# EAGLE design arduino_board_shield (EAGLE 5.11)
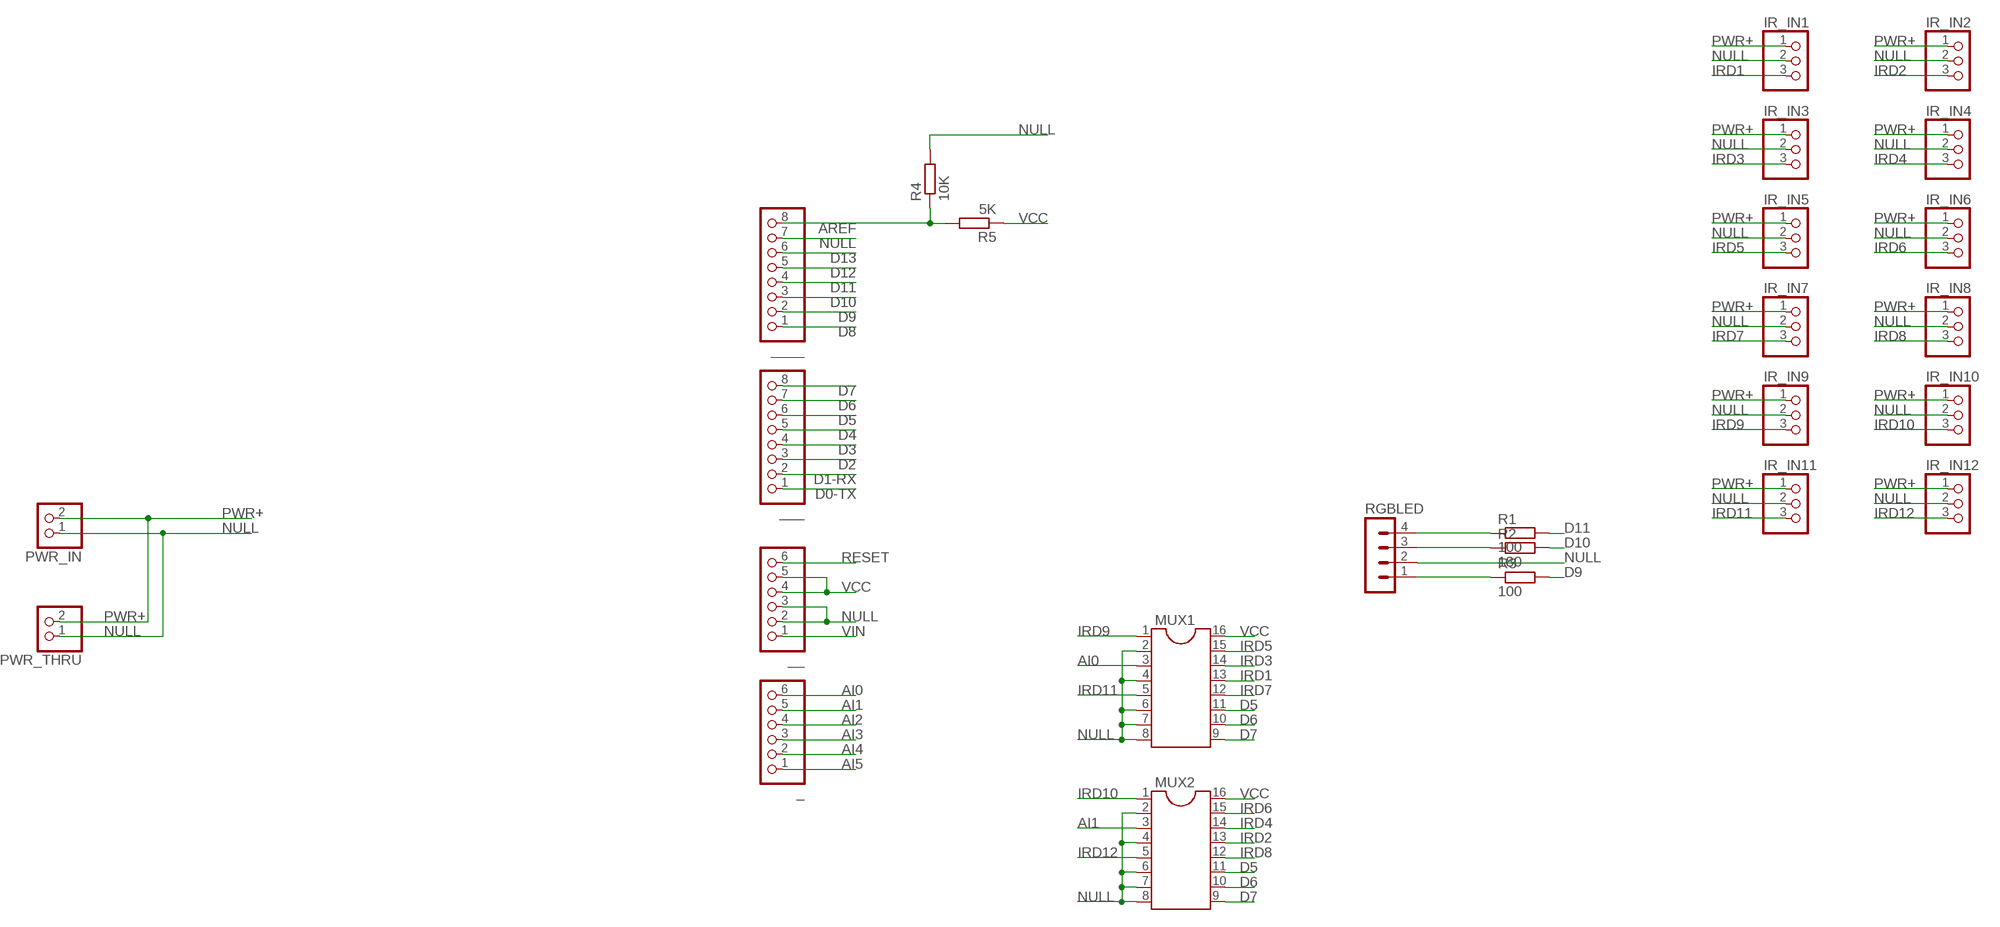
[diagram p0: schematic, sheet 1]

## Parts
_  PINHD-1X6  [1X06]
__  PINHD-1X6  [1X06]
___  PINHD-1X8  [1X08]
____  PINHD-1X8  [1X08]
IR_IN1  PINHD-1X3  [1X03]
IR_IN2  PINHD-1X3  [1X03]
IR_IN3  PINHD-1X3  [1X03]
IR_IN4  PINHD-1X3  [1X03]
IR_IN5  PINHD-1X3  [1X03]
IR_IN6  PINHD-1X3  [1X03]
IR_IN7  PINHD-1X3  [1X03]
IR_IN8  PINHD-1X3  [1X03]
IR_IN9  PINHD-1X3  [1X03]
IR_IN10  PINHD-1X3  [1X03]
IR_IN11  PINHD-1X3  [1X03]
IR_IN12  PINHD-1X3  [1X03]
MUX1  DIL16S  [SOCKET-16]
MUX2  DIL16S  [SOCKET-16]
PWR_IN  PINHD-1X2  [1X02]
PWR_THRU  PINHD-1X2  [1X02]
R1  100  R-EU_0204/7  [0204/7]
R2  180  R-EU_0204/7  [0204/7]
R3  100  R-EU_0204/7  [0204/7]
R4  10K  R-EU_0204/7  [0204/7]
R5  5K  R-EU_0204/7  [0204/7]
RGBLED  MA04-1  [MA04-1]

## Nets
AI0: _.6 MUX1.3
AI1: _.5 MUX2.3
AI2: _.4
AI3: _.3
AI4: _.2
AI5: _.1
AREF: ____.8 R4.1 R5.2
D0-TX: ___.1
D1-RX: ___.2
D2: ___.3
D3: ___.4
D4: ___.5
D5: ___.6 MUX1.11 MUX2.11
D6: ___.7 MUX1.10 MUX2.10
D7: ___.8 MUX1.9 MUX2.9
D8: ____.1
D9: ____.2 R3.2
D10: ____.3 R2.2
D11: ____.4 R1.2
D12: ____.5
D13: ____.6
IRD1: IR_IN1.3 MUX1.13
IRD2: IR_IN2.3 MUX2.13
IRD3: IR_IN3.3 MUX1.14
IRD4: IR_IN4.3 MUX2.14
IRD5: IR_IN5.3 MUX1.15
IRD6: IR_IN6.3 MUX2.15
IRD7: IR_IN7.3 MUX1.12
IRD8: IR_IN8.3 MUX2.12
IRD9: IR_IN9.3 MUX1.1
IRD10: IR_IN10.3 MUX2.1
IRD11: IR_IN11.3 MUX1.5
IRD12: IR_IN12.3 MUX2.5
N$1: R3.1 RGBLED.1
N$2: R2.1 RGBLED.3
N$3: R1.1 RGBLED.4
NULL: __.2 __.3 ____.7 IR_IN1.2 IR_IN2.2 IR_IN3.2 IR_IN4.2 IR_IN5.2 IR_IN6.2 IR_IN7.2 IR_IN8.2 IR_IN9.2 IR_IN10.2 IR_IN11.2 IR_IN12.2 MUX1.2 MUX1.4 MUX1.6 MUX1.7 MUX1.8 MUX2.2 MUX2.4 MUX2.6 MUX2.7 MUX2.8 PWR_IN.1 PWR_THRU.1 R4.2 RGBLED.2
PWR+: IR_IN1.1 IR_IN2.1 IR_IN3.1 IR_IN4.1 IR_IN5.1 IR_IN6.1 IR_IN7.1 IR_IN8.1 IR_IN9.1 IR_IN10.1 IR_IN11.1 IR_IN12.1 PWR_IN.2 PWR_THRU.2
RESET: __.6
VCC: __.4 __.5 MUX1.16 MUX2.16 R5.1
VIN: __.1

## Library data of the parts
_ __ = pinhead:PINHD-1X6: PIN HEADER
___ ____ = pinhead:PINHD-1X8: PIN HEADER
IR_IN1-IR_IN12 = pinhead:PINHD-1X3: PIN HEADER
MUX1 MUX2 = ic-package:DIL16: Dual In Line / Socket
PWR_IN PWR_THRU = pinhead:PINHD-1X2: PIN HEADER
R1-R5 = resistor:R-EU_: RESISTOR, European symbol
RGBLED = con-lstb:MA04-1: PIN HEADER

## Board
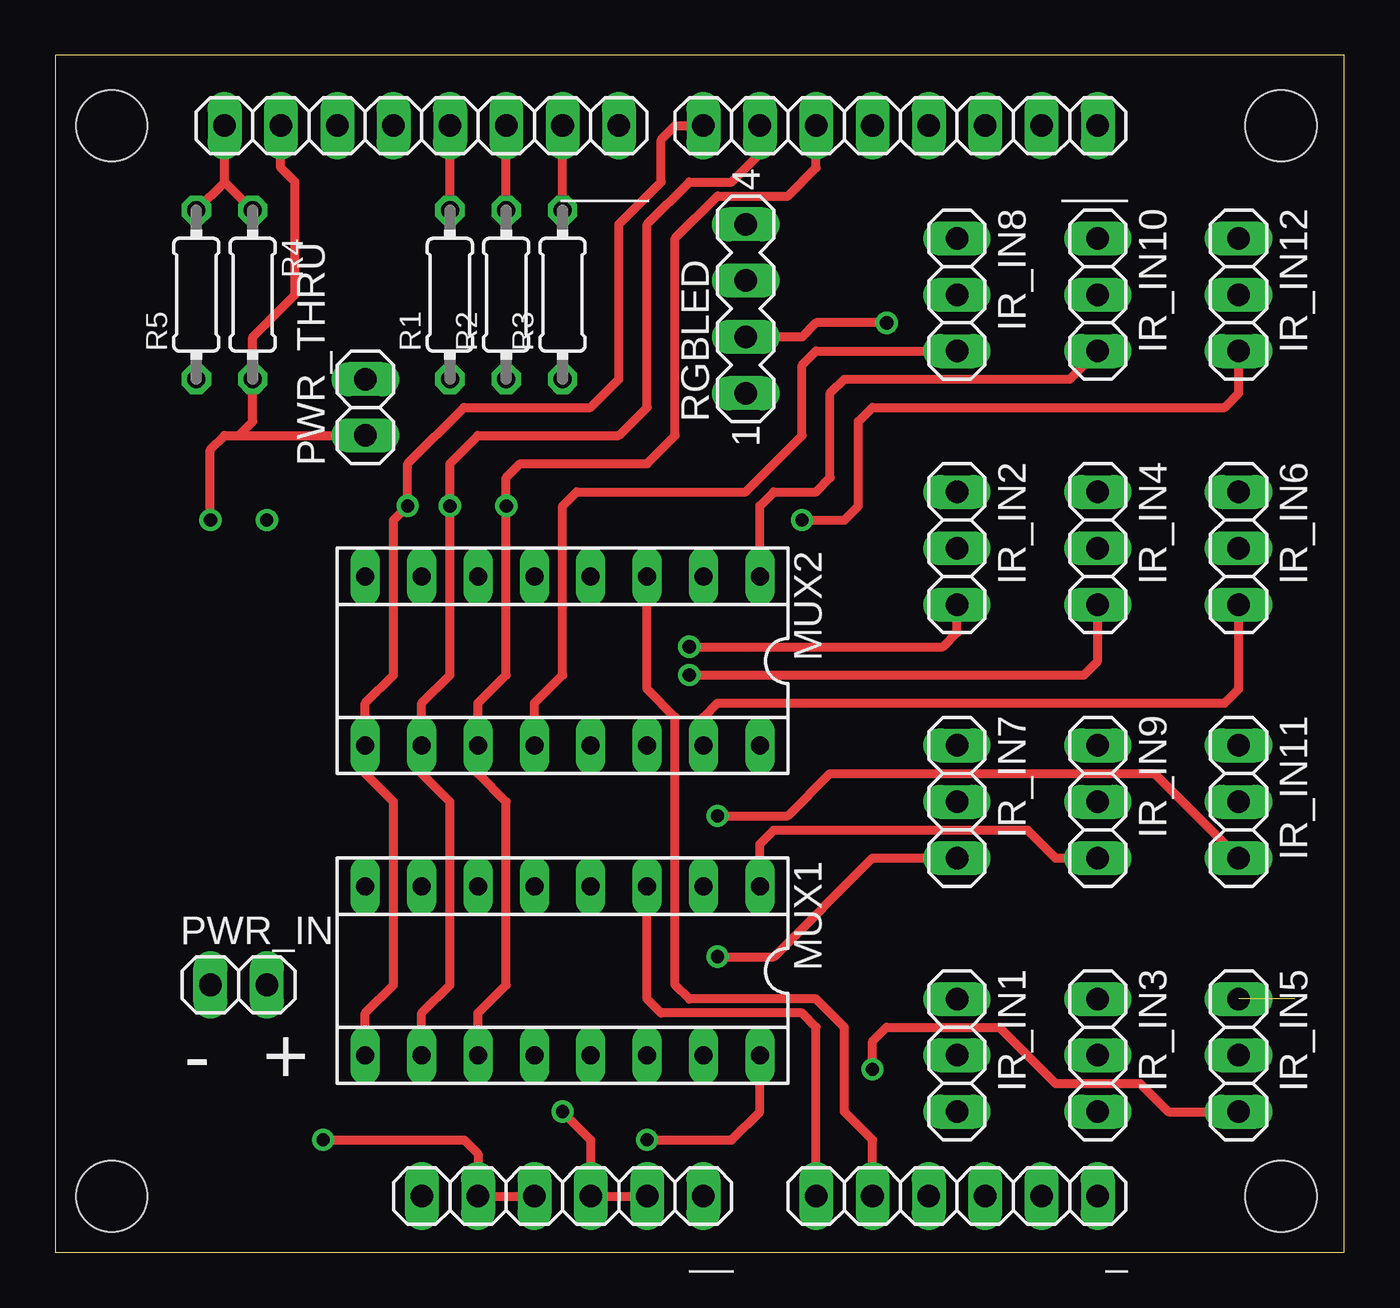
[diagram p1: board, top side]
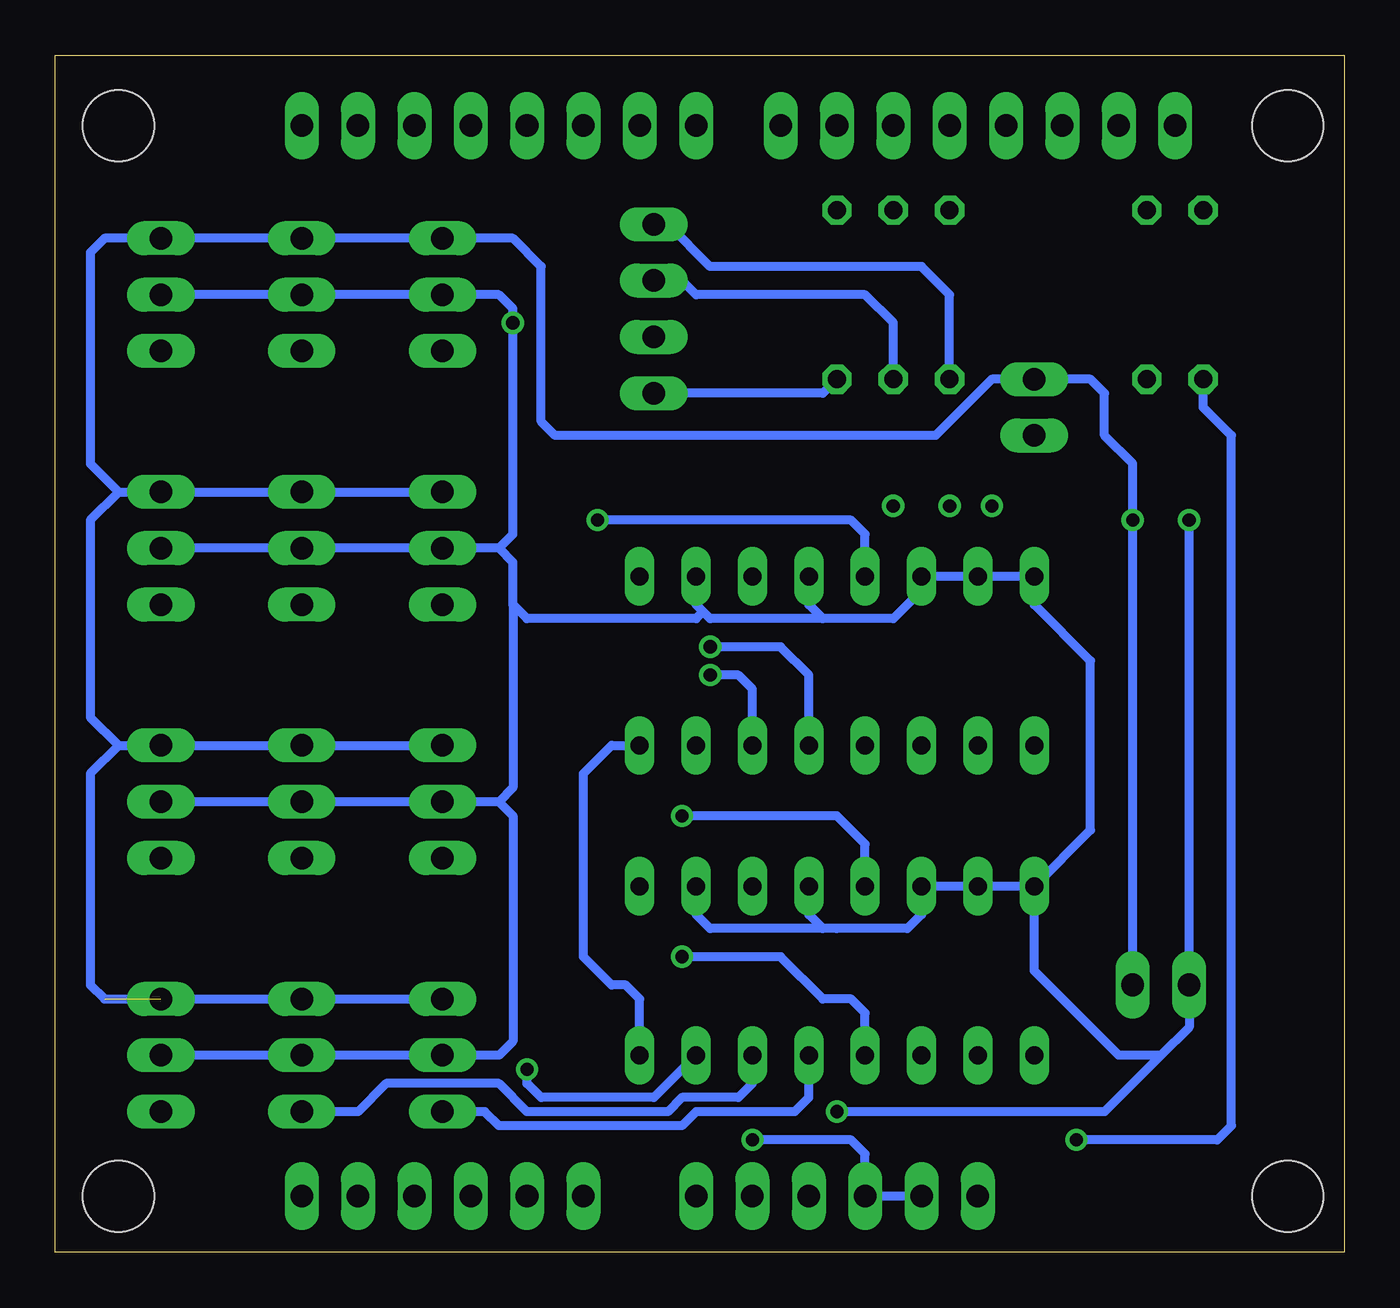
[diagram p2: board, bottom side, seen from below]

Size 58.09 x 53.97 mm. Coordinates in mm from the lower left corner, seen from the top.
Outline: 0,0 58.09,0 58.09,53.97 0,53.97 0,0
Copper layers (1*16): Top 0.035mm / dielectric 1.5mm / Bottom 0.035mm
Design rules "default": minimum track width 10mil, minimum drill 24mil, track to track 8mil, track to pad 8mil, pad to pad 8mil, via to via 8mil, smd to smd 8mil, copper to edge 40mil, drill to drill 8mil, minimum pad ring 10mil, minimum via ring 8mil, stop-mask expansion 4mil, vias tented up to drill 0mil, thermal gap 10mil
Holes 3.2 mm at 2.54,2.54 2.54,50.8 55.24,50.8 55.24,2.54

### Footprints (pad centres in the part's own frame; a part is rotated, then mirrored left to right if it is on the bottom)
1X06 = drill 1.016 long: 1 -6.35,0; 2 -3.81,0; 3 -1.27,0; 4 1.27,0; 5 3.81,0; 6 6.35,0
1X08 = drill 1.016 long: 1 -8.89,0; 2 -6.35,0; 3 -3.81,0; 4 -1.27,0; 5 1.27,0; 6 3.81,0; 7 6.35,0; 8 8.89,0
1X03 = drill 1.016 long: 1 -2.54,0; 2 0,0; 3 2.54,0
SOCKET-16 = drill 0.813 long: 1 -8.89,-3.81; 2 -6.35,-3.81; 3 -3.81,-3.81; 4 -1.27,-3.81; 5 1.27,-3.81; 6 3.81,-3.81; 7 6.35,-3.81; 8 8.89,-3.81; 9 8.89,3.81; 10 6.35,3.81; 11 3.81,3.81; 12 1.27,3.81; 13 -1.27,3.81; 14 -3.81,3.81; 15 -6.35,3.81; 16 -8.89,3.81
1X02 = drill 1.016 long: 1 -1.27,0; 2 1.27,0
0204/7 = drill 0.813 octagon: 1 -3.81,0; 2 3.81,0
MA04-1 = drill 1.016 long: 1 -3.81,0; 2 -1.27,0; 3 1.27,0; 4 3.81,0

### Placement (x,y rotation side)
_  40.64,2.54 180 top
__  22.86,2.54 180 top
___  38.1,50.8 180 top
____  16.51,50.8 180 top
IR_IN1  40.64,8.89 270 top
IR_IN2  40.64,31.75 270 top
IR_IN3  46.99,8.89 270 top
IR_IN4  46.99,31.75 270 top
IR_IN5  53.34,8.89 270 top
IR_IN6  53.34,31.75 270 top
IR_IN7  40.64,20.32 270 top
IR_IN8  40.64,43.18 270 top
IR_IN9  46.99,20.32 270 top
IR_IN10  46.99,43.18 270 top
IR_IN11  53.34,20.32 270 top
IR_IN12  53.34,43.18 270 top
MUX1  22.86,12.7 180 top
MUX2  22.86,26.67 180 top
PWR_IN  8.26,12.06 0 top
PWR_THRU  13.97,38.1 90 top
R1  17.78,43.18 90 top
R2  20.32,43.18 90 top
R3  22.86,43.18 90 top
R4  8.89,43.18 270 top
R5  6.35,43.18 90 top
RGBLED  31.11,42.55 90 top

### Tracks (layer width: path | path; a pad name or v marks a point on that pad's centre or on a via)
AI0
  Top 0.406: _.6 34.29,10.16 33.66,10.79 27.3,10.79 26.67,11.43 MUX1.3
AI1
  Top 0.406: _.5 36.83,5.08 35.56,6.35 35.56,10.16 34.29,11.43 28.57,11.43 27.94,12.06 27.94,24.13 26.67,25.4 MUX2.3
AREF
  Top 0.406: 7.62,48.26 ____.8 | R5.2 7.62,48.26 | 7.62,48.26 R4.1
D5  (via drill 0.6)
  Top 0.406: MUX1.11 19.05,10.79 20.32,12.06 20.32,20.32 19.05,21.59 MUX2.11 19.05,24.77 20.32,26.04 v20.32,33.66 20.32,34.92 20.95,35.56 26.67,35.56 27.94,36.83 27.94,45.72 29.84,47.62 33.02,47.62 34.29,48.9 ___.6
D6  (via drill 0.6)
  Top 0.406: MUX1.10 16.51,10.79 17.78,12.06 17.78,20.32 16.51,21.59 MUX2.10 16.51,24.77 17.78,26.04 v17.78,33.66 17.78,35.56 19.05,36.83 25.4,36.83 26.67,38.1 26.67,46.35 28.57,48.26 30.48,48.26 31.75,49.53 ___.7
D7  (via drill 0.6)
  Top 0.406: ___.8 27.94,50.8 27.3,50.16 27.3,48.26 25.4,46.35 25.4,39.37 24.13,38.1 18.41,38.1 15.88,35.56 v15.88,33.66 15.24,33.02 15.24,26.04 13.97,24.77 MUX2.9 13.97,21.59 15.24,20.32 15.24,12.06 13.97,10.79 MUX1.9
D9
  Top 0.406: R3.2 ____.2
D10
  Top 0.406: R2.2 ____.3
D11
  Top 0.406: R1.2 ____.4
IRD1
  Bottom 0.406: MUX1.13 24.13,6.99 24.77,6.35 29.21,6.35 29.84,5.71 38.1,5.71 38.73,6.35 IR_IN1.3
IRD2  (via drill 0.6)
  Top 0.406: IR_IN2.3 40.64,27.94 40.01,27.3 v28.57,27.3
  Bottom 0.406: MUX2.13 24.13,26.04 25.4,27.3 v28.57,27.3
IRD3
  Bottom 0.406: MUX1.14 26.67,7.62 27.3,6.99 29.84,6.99 30.48,6.35 36.83,6.35 38.1,7.62 43.18,7.62 44.45,6.35 IR_IN3.3
IRD4  (via drill 0.6)
  Top 0.406: IR_IN4.3 46.99,26.67 46.35,26.04 v28.57,26.04
  Bottom 0.406: MUX2.14 26.67,25.4 27.3,26.04 v28.57,26.04
IRD5  (via drill 0.6)
  Top 0.406: IR_IN5.3 50.16,6.35 48.9,7.62 45.09,7.62 42.55,10.16 37.47,10.16 36.83,9.53 v36.83,8.26
  Bottom 0.406: v36.83,8.26 36.83,7.62 36.2,6.99 31.11,6.99 MUX1.15
IRD6
  Top 0.406: IR_IN6.3 53.34,25.4 52.7,24.77 29.84,24.77 29.21,24.13 MUX2.15
IRD7  (via drill 0.6)
  Top 0.406: v29.84,13.34 32.38,13.34 36.83,17.78 IR_IN7.3
  Bottom 0.406: MUX1.12 21.59,10.79 22.23,11.43 23.5,11.43 25.4,13.34 v29.84,13.34
IRD8
  Top 0.406: IR_IN8.3 34.29,40.64 33.66,40.01 33.66,36.83 31.11,34.29 23.5,34.29 22.86,33.66 22.86,26.04 21.59,24.77 MUX2.12
IRD9
  Top 0.406: IR_IN9.3 45.09,17.78 43.81,19.05 32.38,19.05 31.75,18.41 MUX1.1
IRD10
  Top 0.406: IR_IN10.3 45.72,39.37 35.56,39.37 34.92,38.73 34.92,34.92 34.29,34.29 32.38,34.29 31.75,33.66 MUX2.1
IRD11  (via drill 0.6)
  Top 0.406: IR_IN11.3 49.53,21.59 34.92,21.59 33.02,19.68 v29.84,19.68
  Bottom 0.406: MUX1.5 21.59,18.41 22.86,19.68 v29.84,19.68
IRD12  (via drill 0.6)
  Top 0.406: IR_IN12.3 53.34,38.73 52.7,38.1 36.83,38.1 36.2,37.47 36.2,33.66 35.56,33.02 v33.66,33.02
  Bottom 0.406: v33.66,33.02 22.23,33.02 21.59,32.38 MUX2.5
N$1
  Bottom 0.406: RGBLED.1 23.5,38.73 R3.1
N$2
  Bottom 0.406: RGBLED.3 29.84,43.81 29.21,43.18 21.59,43.18 20.32,41.91 R2.1
N$3
  Bottom 0.406: RGBLED.4 30.48,46.35 28.57,44.45 19.05,44.45 17.78,43.18 R1.1
NULL  (via drill 0.6)
  Top 0.406: 8.26,36.83 7.62,36.83 6.99,36.2 v6.99,33.02 | 8.26,36.83 PWR_THRU.1 | 8.26,36.83 8.89,37.47 R4.2 8.89,41.27 10.79,43.18 10.79,48.26 10.16,48.9 ____.7 | RGBLED.2 33.66,41.27 34.29,41.91 v37.47,41.91 | __.2 __.3 24.13,5.08 v22.86,6.35
  Bottom 0.406: 38.1,31.75 37.47,32.38 v37.47,41.91 37.47,42.55 38.1,43.18 IR_IN8.2 IR_IN10.2 IR_IN12.2 | 38.1,20.32 37.47,20.95 37.47,29.21 | 38.1,31.75 37.47,31.11 37.47,29.21 | 38.1,20.32 37.47,19.68 37.47,9.53 38.1,8.89 IR_IN1.2 IR_IN3.2 IR_IN5.2 | MUX1.8 MUX1.7 MUX1.6 19.05,15.24 19.68,14.61 22.86,14.61 23.5,14.61 | 23.5,28.57 20.32,28.57 19.05,29.84 MUX2.6 MUX2.7 MUX2.8 13.97,29.21 11.43,26.67 11.43,19.05 MUX1.8 | 23.5,28.57 28.57,28.57 28.89,28.89 | 28.89,28.89 29.21,29.21 MUX2.2 | MUX2.4 24.13,29.21 23.5,28.57 | v6.99,33.02 PWR_IN.1 6.99,10.16 8.26,8.89 | 37.47,29.21 36.83,28.57 29.21,28.57 28.89,28.89 | IR_IN11.2 IR_IN9.2 IR_IN7.2 38.1,20.32 | IR_IN6.2 IR_IN4.2 IR_IN2.2 38.1,31.75 | MUX1.8 13.97,12.7 10.16,8.89 8.26,8.89 | v22.86,6.35 10.79,6.35 8.26,8.89 | 23.5,14.61 24.13,15.24 MUX1.4 | MUX1.2 29.21,15.24 28.57,14.61 23.5,14.61
PWR+  (via drill 0.6)  (1 unrouted)
  Bottom 0.406: 55.24,34.29 56.52,35.56 56.52,45.09 55.88,45.72 IR_IN12.1 IR_IN10.1 IR_IN8.1 37.47,45.72 36.2,44.45 36.2,37.47 35.56,36.83 18.41,36.83 15.88,39.37 PWR_THRU.2 11.43,39.37 10.79,38.73 10.79,36.83 9.53,35.56 v9.53,33.02 PWR_IN.2 | 40.01,34.29 IR_IN2.1 IR_IN4.1 IR_IN6.1 55.24,34.29 | 55.24,22.86 54.61,22.86 IR_IN11.1 IR_IN9.1 IR_IN7.1 | 55.24,22.86 56.52,24.13 56.52,33.02 55.24,34.29 | 55.24,22.86 56.52,21.59 56.52,12.06 55.88,11.43 IR_IN3.1 IR_IN1.1
VCC  (via drill 0.6)
  Top 0.406: __.4 __.5 19.05,4.45 18.41,5.08 v12.06,5.08 | v26.67,5.08 30.48,5.08 31.75,6.35 MUX1.16
  Bottom 0.406: __.5 __.4 21.59,4.45 22.23,5.08 v26.67,5.08 | MUX2.16 33.02,22.86 34.29,21.59 34.29,13.34 33.02,12.06 32.38,12.06 31.75,11.43 MUX1.16 | R5.1 6.35,38.1 5.08,36.83 5.08,5.71 5.71,5.08 v12.06,5.08

### Text on the board
tNames: - | +